# Altium schematic sheet Public_Ethernet_Switch.SchDoc
size D
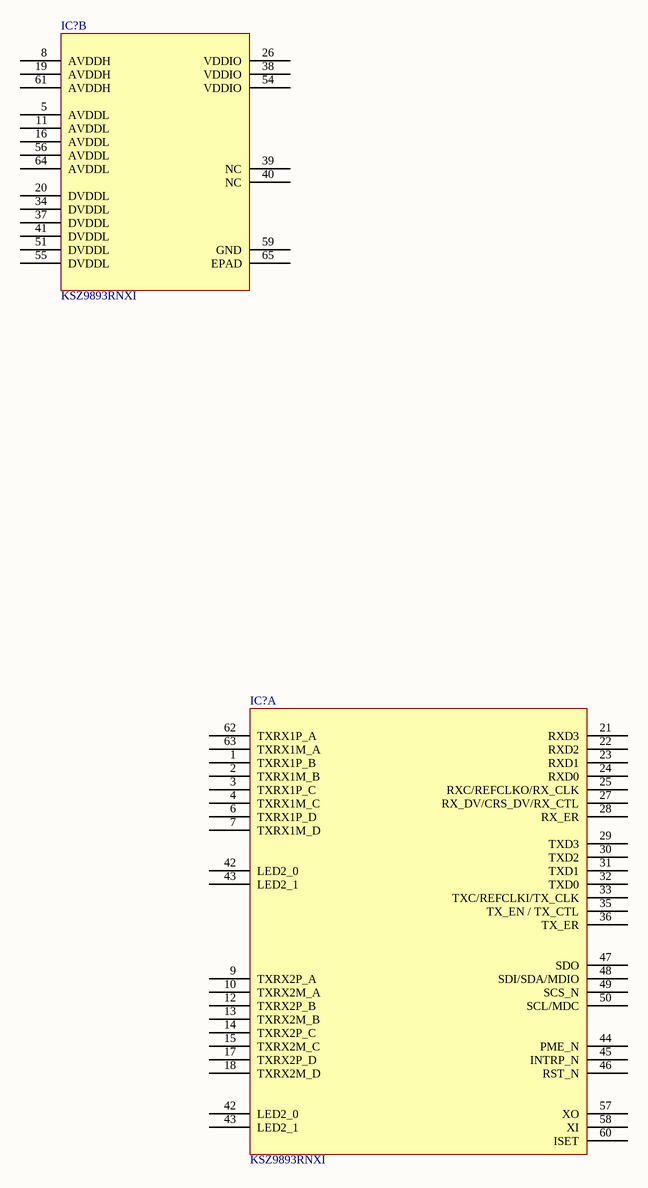
[diagram p0: Public_Ethernet_Switch.SchDoc]

## Parts
(Parts that share a designator on the sheet are numbered #1, #2 ... from top to bottom, then left to right.)
IC?#1  KSZ9893RNXI  [QFN40P800X800X90-65N]  (part B of 2)
IC?#2  KSZ9893RNXI  [QFN40P800X800X90-65N]  (part A of 2)

## Nets

Not connected (* = marked no-connect by the designer): IC?#1 5(AVDDL) 8(AVDDH) 11(AVDDL) 16(AVDDL) 19(AVDDH) 20(DVDDL) 26(VDDIO) 34(DVDDL) 37(DVDDL) 38(VDDIO) 39(NC) 40(NC) 41(DVDDL) 51(DVDDL) 54(VDDIO) 55(DVDDL) 56(AVDDL) 59(GND) 61(AVDDH) 64(AVDDL) 65(EPAD); IC?#2 1(TXRX1P_B) 2(TXRX1M_B) 3(TXRX1P_C) 4(TXRX1M_C) 6(TXRX1P_D) 7(TXRX1M_D) 9(TXRX2P_A) 10(TXRX2M_A) 12(TXRX2P_B) 13(TXRX2M_B) 14(TXRX2P_C) 15(TXRX2M_C) 17(TXRX2P_D) 18(TXRX2M_D) 21(RXD3) 22(RXD2) 23(RXD1) 24(RXD0) 25(RXC/REFCLKO/RX_CLK) 27(RX_DV/CRS_DV/RX_CTL) 28(RX_ER) 29(TXD3) 30(TXD2) 31(TXD1) 32(TXD0) 33(TXC/REFCLKI/TX_CLK) 35(TX_EN_/_TX_CTL) 36(TX_ER) 42(LED2_0) 43(LED2_1) 44(PME_N) 45(INTRP_N) 46(RST_N) 47(SDO) 48(SDI/SDA/MDIO) 49(SCS_N) 50(SCL/MDC) 57(XO) 58(XI) 60(ISET) 62(TXRX1P_A) 63(TXRX1M_A)

## Notes on the sheet
- Title
- Size:
- Date:
- File:
- D
- Number:
- Time:
- Revision:
- Sheet
- of

## Library data of the parts
IC?#1 IC?#2 = KSZ9893RNXI: Integrated Circuit; Manufacturer_Name: Microchip; Datasheet Link: http://ww1.microchip.com/downloads/en/devicedoc/00002318a.pdf; Height: 0.9mm; Manufacturer_Part_Number: KSZ9893RNXI; Mouser Part Number: 579-KSZ9893RNXI; Mouser Price/Stock: https://www.mouser.co.uk/ProductDetail/Microchip-Technology/KSZ9893RNXI?qs=qpJ%252B%252B%252Bdg6p18d2XhRUC1wQ%3D%3D